# EAGLE design gerbang fix2 (EAGLE 6.6.0)
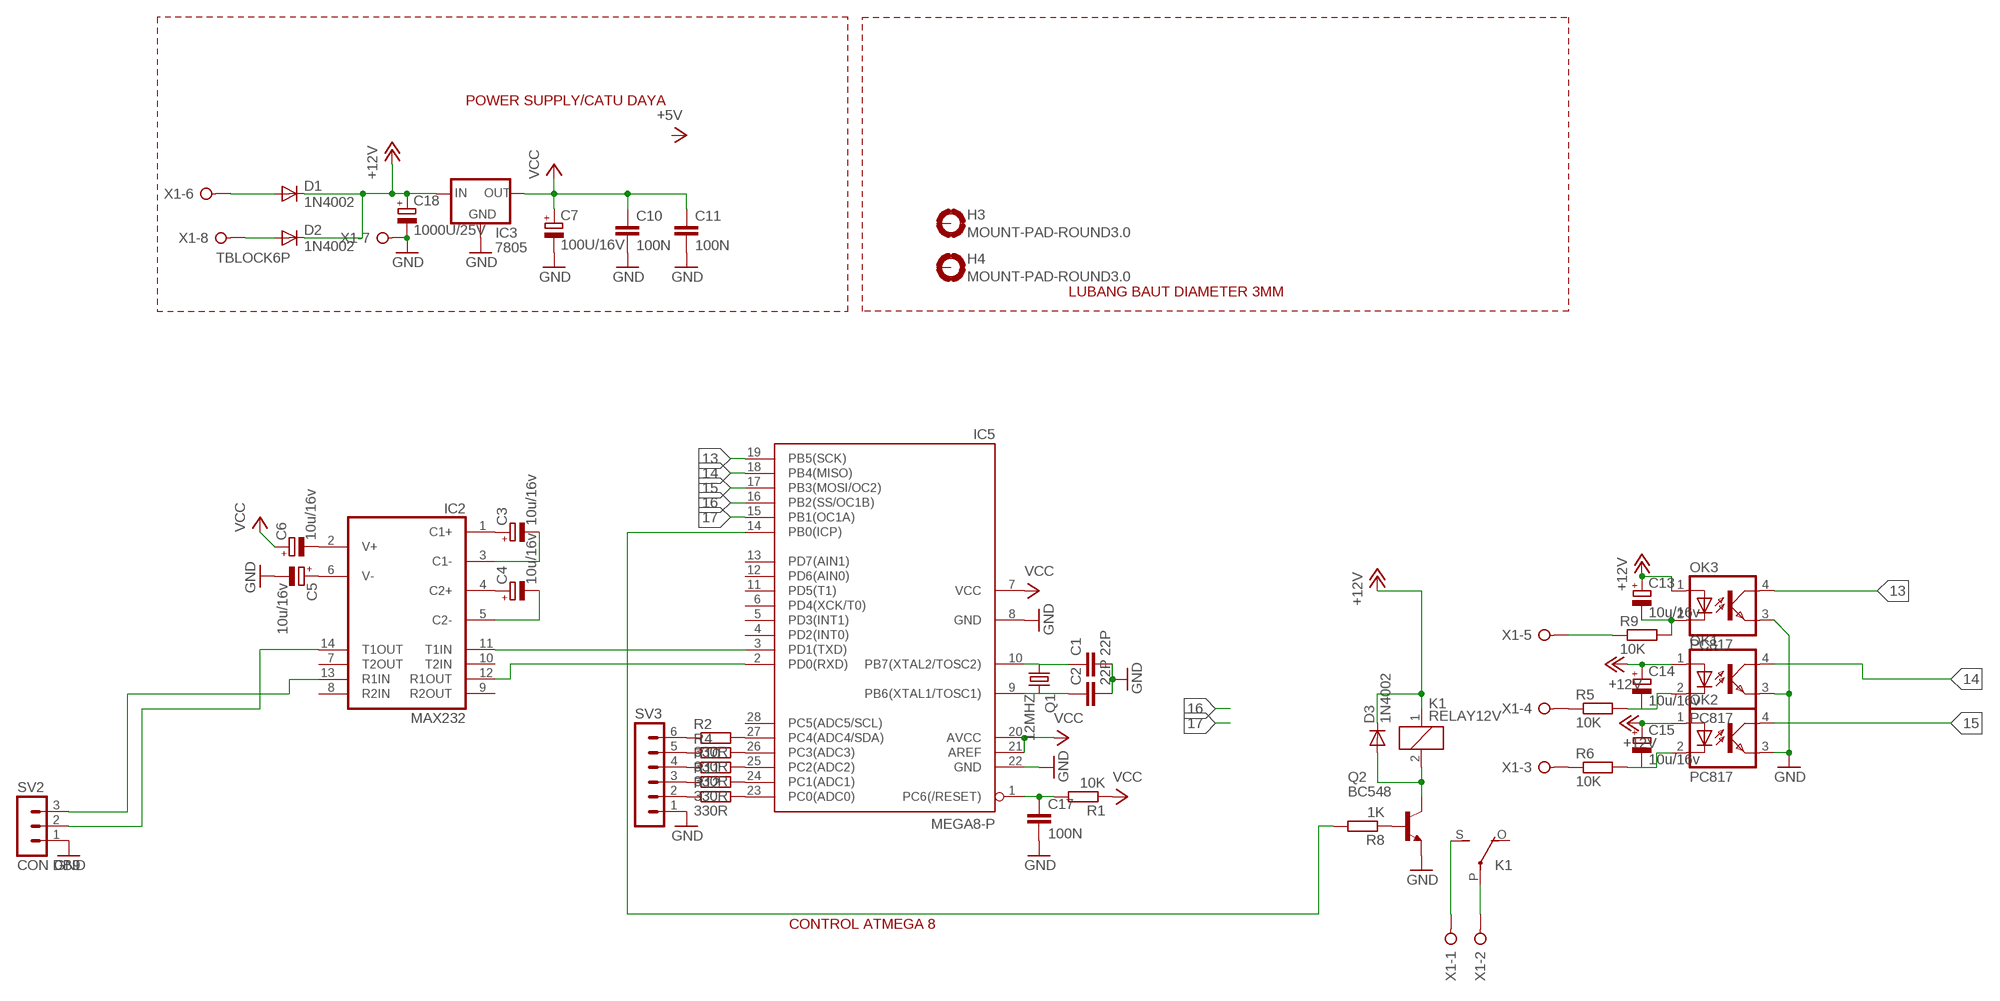
[diagram p0: schematic, sheet 1]

## Parts
C1  22P  C-EU025-025X050  [C025-025X050]
C2  22P  C-EU025-025X050  [C025-025X050]
C3  10u/16v  CPOL-EUE2.5-6  [E2,5-6]
C4  10u/16v  CPOL-EUE2.5-6  [E2,5-6]
C5  10u/16v  CPOL-EUE2.5-6  [E2,5-6]
C6  10u/16v  CPOL-EUE2.5-6  [E2,5-6]
C7  100U/16V  CPOL-EUE2.5-6  [E2,5-6]
C10  100N  C-EU025-025X050  [C025-025X050]
C11  100N  C-EU025-025X050  [C025-025X050]
C13  10u/16v  CPOL-EUE2.5-6  [E2,5-6]
C14  10u/16v  CPOL-EUE2.5-6  [E2,5-6]
C15  10u/16v  CPOL-EUE2.5-6  [E2,5-6]
C17  100N  C-EU025-025X050  [C025-025X050]
C18  1000U/25V  CPOL-EUE5-8.5  [E5-8,5]
D1  1N4002  1N4148DO35-10  [DO35-10]
D2  1N4002  1N4148DO35-10  [DO35-10]
D3  1N4002  1N4148DO35-10  [DO35-10]
H3  MOUNT-PAD-ROUND3.0  [3,0-PAD]
H4  MOUNT-PAD-ROUND3.0  [3,0-PAD]
IC2  MAX232  [DIL16]
IC3  7805  78XXS  [78XXS]
IC5  MEGA8-P  [DIL28-3]
K1  RELAY12V  ZF112  [ZF112]
OK1  PC817  [DIL04]
OK2  PC817  [DIL04]
OK3  PC817  [DIL04]
Q1  12MHZ  CRYSTALHC49U-V  [HC49U-V]
Q2  BC548  [TO92-EBC]
R1  10K  R-EU_0207/10  [0207/10]
R2  330R  R-EU_0204/2V  [0204V]
R4  330R  R-EU_0204/2V  [0204V]
R5  10K  R-EU_0204/2V  [0204V]
R6  10K  R-EU_0204/2V  [0204V]
R8  1K  R-EU_0207/10  [0207/10]
R9  10K  R-EU_0204/2V  [0204V]
R10  330R  R-EU_0204/2V  [0204V]
R11  330R  R-EU_0204/2V  [0204V]
R12  330R  R-EU_0204/2V  [0204V]
SV2  CON DB9  MA03-1  [MA03-1]
SV3  MA06-1  [MA06-1]
X1  TBLOCK6P  W237-08P  [W237-8P]

## Nets
13: IC5.19(PB5(SCK)) OK3.4(COL)
14: IC5.18(PB4(MISO)) OK1.4(COL)
15: IC5.17(PB3(MOSI/OC2)) OK2.4(COL)
16: IC5.16(PB2(SS/OC1B))
17: IC5.15(PB1(OC1A))
+12V: C13.+ C14.+ C15.+ C18.+ D1.C D2.C D3.C IC3.IN K1.1 OK1.1(A) OK2.1(A) OK3.1(A)
GND: C1.2 C2.2 C5.- C7.- C10.2 C11.2 C17.2 C18.- IC3.GND IC5.8(GND) IC5.22(GND) OK1.3(EMIT) OK2.3(EMIT) OK3.3(EMIT) Q2.E SV2.1 SV3.1 X1.7
N$1: C17.1 IC5.1(PC6(/RESET)) R1.2
N$4: IC5.14(PB0(ICP)) R8.2
N$8: R9.1 X1.5
N$9: D1.A X1.6
N$10: IC2.12(R1OUT) IC5.2(PD0(RXD))
N$11: IC2.11(T1IN) IC5.3(PD1(TXD))
N$12: C2.1 IC5.9(PB6(XTAL1/TOSC1)) Q1.2
N$13: C1.1 IC5.10(PB7(XTAL2/TOSC2)) Q1.1
N$15: R5.1 X1.4
N$16: C3.+ IC2.1(C1+)
N$17: C3.- IC2.3(C1-)
N$19: D2.A X1.8
N$20: IC5.27(PC4(ADC4/SDA)) R2.2
N$21: R6.1 X1.3
N$22: C4.+ IC2.4(C2+)
N$23: C4.- IC2.5(C2-)
N$24: C5.+ IC2.6(V-)
N$25: C6.- IC2.2(V+)
N$26: IC2.13(R1IN) SV2.3
N$27: IC2.14(T1OUT) SV2.2
N$29: K1.S(2:S) X1.1
N$30: K1.P(2:P) X1.2
N$31: C13.- OK3.2(C) R9.2
N$32: C14.- OK1.2(C) R5.2
N$33: C15.- OK2.2(C) R6.2
N$34: D3.A K1.2 Q2.C
N$35: IC5.26(PC3(ADC3)) R4.2
N$36: Q2.B R8.1
N$37: IC5.25(PC2(ADC2)) R10.2
N$38: IC5.24(PC1(ADC1)) R11.2
N$39: IC5.23(PC0(ADC0)) R12.2
N$40: R2.1 SV3.6
N$41: R4.1 SV3.5
N$42: R10.1 SV3.4
N$43: R11.1 SV3.3
N$44: R12.1 SV3.2
VCC: C6.+ C7.+ C10.1 C11.1 IC3.OUT IC5.7(VCC) IC5.20(AVCC) IC5.21(AREF) R1.1
Unconnected: H3.B3,0(MOUNT) H4.B3,0(MOUNT) IC2.7(T2OUT) IC2.8(R2IN) IC2.9(R2OUT) IC2.10(T2IN) IC5.4(PD2(INT0)) IC5.5(PD3(INT1)) IC5.6(PD4(XCK/T0)) IC5.11(PD5(T1)) IC5.12(PD6(AIN0)) IC5.13(PD7(AIN1)) IC5.28(PC5(ADC5/SCL)) K1.O(2:O)

## Notes on the sheet
- POWER SUPPLY/CATU DAYA
- LUBANG BAUT DIAMETER 3MM
- CONTROL ATMEGA 8

## Power pins joined to a net without a drawn wire
GND: IC2.15(GND)
VCC: IC2.16(VCC)

## Library data of the parts
C1 C2 C10 C11 C17 = resistor:C-EU: CAPACITOR, European symbol
C3-C7 C13-C15 = resistor:CPOL-EU: POLARIZED CAPACITOR, European symbol
C18 = rcl:CPOL-EU: POLARIZED CAPACITOR, European symbol
D1-D3 = diode:1N4148: DIODE high speed (Philips)
H3 H4 = holes:MOUNT-PAD-ROUND: MOUNTING PAD, round
IC2 = maxim:MAX232: RS232 TRANSEIVER; MF: MAXIM; MPN: MAX232ACPE+; OC_FARNELL: 9723773; OC_NEWARK: 68K4544
IC3 = v-reg:78XXS: VOLTAGE REGULATOR
IC5 = atmel:MEGA8-P: MICROCONTROLLER 8 Kbytes FLASH, 1 kbytes SRAM, 512 bytes EEPROM, USART, 4-channel 10 bit ADC, 2-channel 8 bit ADC Pin compatible with Atmega48, ATMega88, ATMega168 Source: avr.lbr; OC_FARNELL: unknown; OC_NEWARK: unknown
K1 = relay:ZF112: RELAY 1 x switch; OC_FARNELL: unknown; OC_NEWARK: unknown
OK1-OK3 = optocoupler:PC817: SHARP OPTO COUPLER; MPN: PC817X4J000F; OC_FARNELL: 9707727; OC_NEWARK: 97K7059
Q1 = crystal:CRYSTAL: CRYSTAL; OC_FARNELL: 1666969; OC_NEWARK: unknown
Q2 = transistor-npn:BC548*: NPN Transistor
R1 R8 = resistor:R-EU_: RESISTOR, European symbol
R2 R4-R6 R9-R12 = rcl:R-EU_: RESISTOR, European symbol
SV2 = con-lstb:MA03-1: PIN HEADER; OC_FARNELL: unknown; OC_NEWARK: unknown
SV3 = con-lstb:MA06-1: PIN HEADER; OC_FARNELL: unknown; OC_NEWARK: unknown
X1 = con-wago-508:W237-08P: WAGO SREW CLAMP; OC_FARNELL: unknown; OC_NEWARK: unknown

## Board
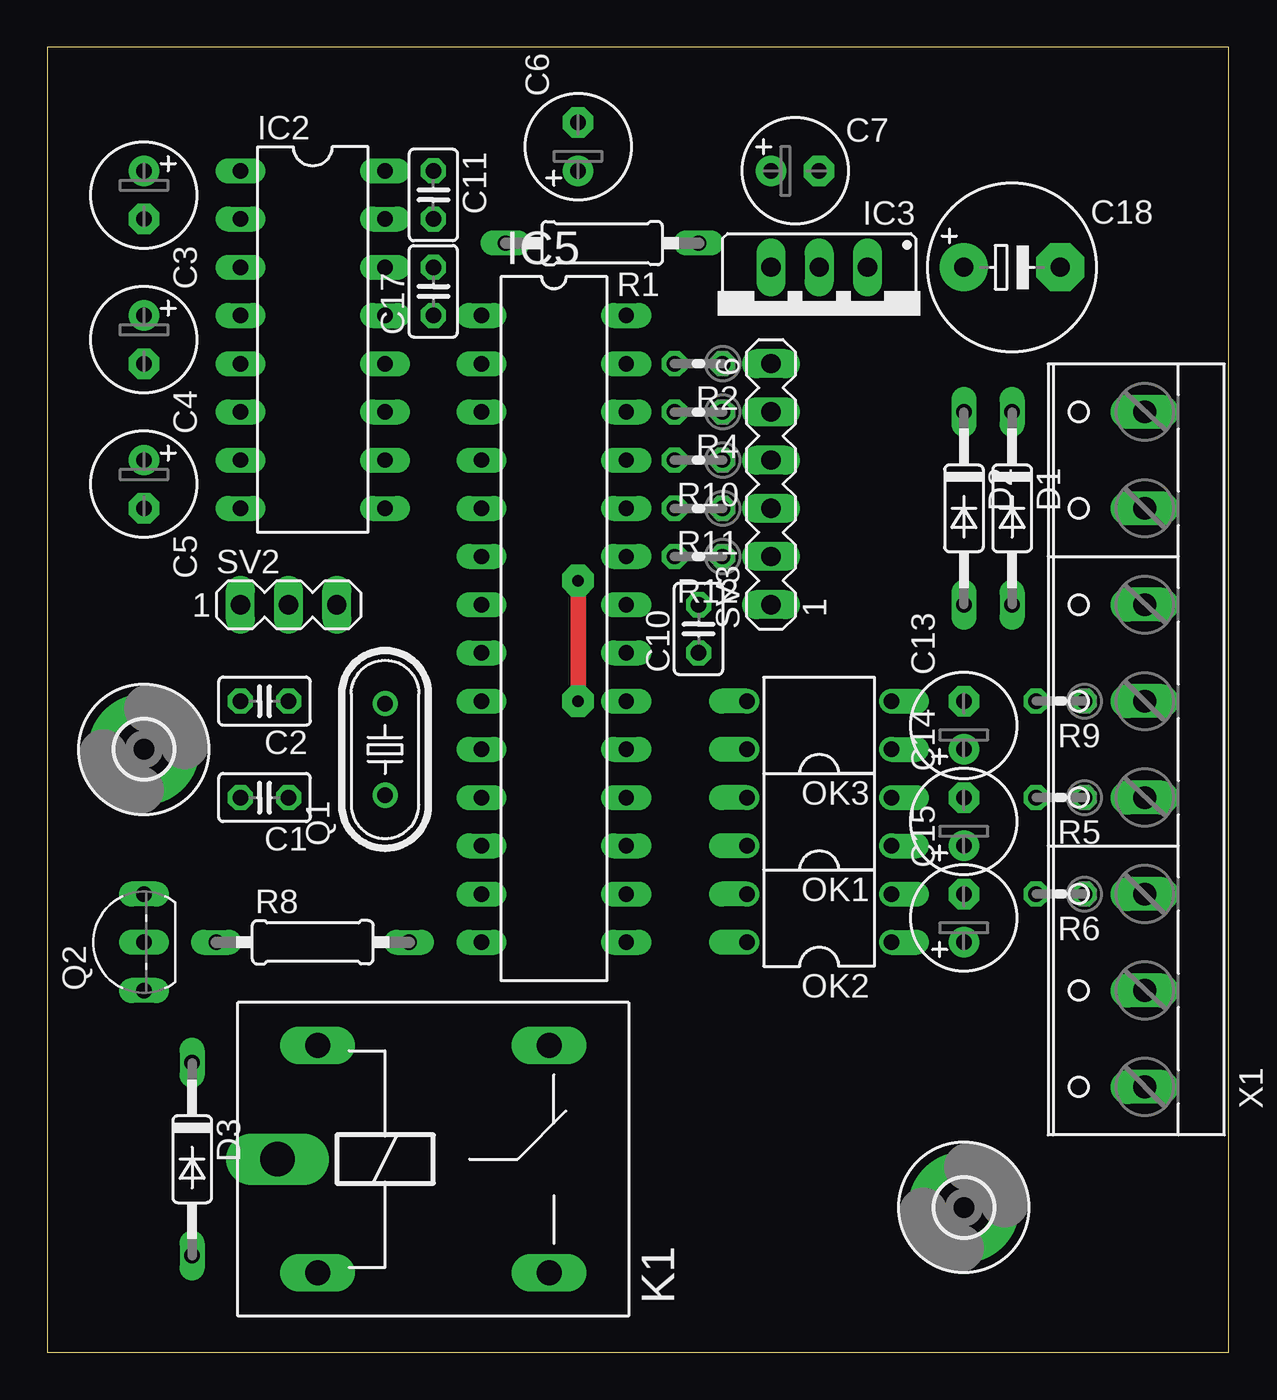
[diagram p1: board, top side]
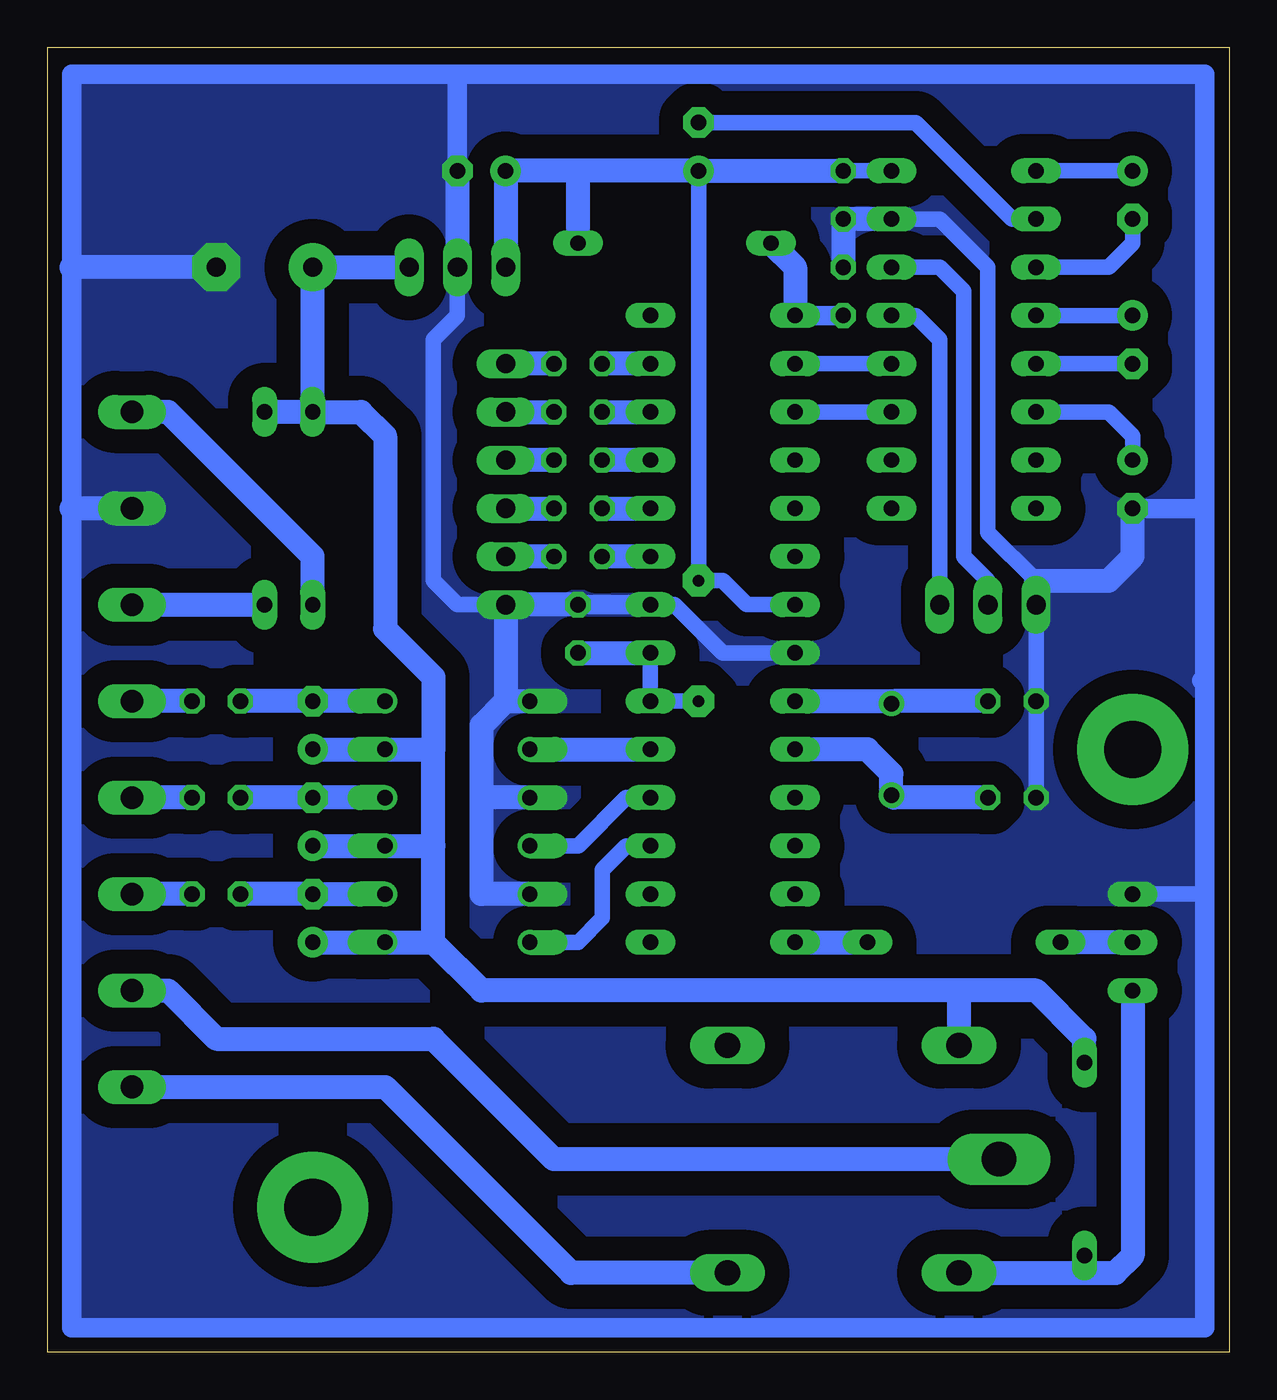
[diagram p2: board, bottom side, seen from below]

Size 62.22 x 68.73 mm. Coordinates in mm from the lower left corner, seen from the top.
Outline: 0,0 62.22,0 62.22,68.73 0,68.73 0,0
Copper layers (1*16): Top 0.035mm / dielectric 1.5mm / Bottom 0.035mm
Design rules "default": minimum track width 10mil, minimum drill 24mil, track to track 8mil, track to pad 8mil, pad to pad 8mil, via to via 8mil, smd to smd 8mil, copper to edge 40mil, drill to drill 8mil, minimum pad ring 10mil, minimum via ring 8mil, stop-mask expansion 4mil, vias tented up to drill 0mil, thermal gap 10mil

### Footprints (pad centres in the part's own frame; a part is rotated, then mirrored left to right if it is on the bottom)
C025-025X050 = drill 0.813 octagon: 1 -1.27,0; 2 1.27,0
E2,5-6 = drill 0.813 pad 1.6: + -1.27,0 | drill 0.813 pad 1.6 octagon: - 1.27,0
E5-8,5 = drill 1.016 pad 2.54: + -2.54,0 | drill 1.016 pad 2.54 octagon: - 2.54,0
DO35-10 = drill 0.813 long: A 5.08,0; C -5.08,0
3,0-PAD = drill 3 pad 5.842: B3,0 0,0
DIL16 = drill 0.813 long: 1 -8.89,-3.81; 2 -6.35,-3.81; 3 -3.81,-3.81; 4 -1.27,-3.81; 5 1.27,-3.81; 6 3.81,-3.81; 7 6.35,-3.81; 8 8.89,-3.81; 9 8.89,3.81; 10 6.35,3.81; 11 3.81,3.81; 12 1.27,3.81; 13 -1.27,3.81; 14 -3.81,3.81; 15 -6.35,3.81; 16 -8.89,3.81
78XXS = drill 1.016 long: GND 0,-2.54; IN -2.54,-2.54; OUT 2.54,-2.54
DIL28-3 = drill 0.813 long: 1 -16.51,-3.81; 2 -13.97,-3.81; 3 -11.43,-3.81; 4 -8.89,-3.81; 5 -6.35,-3.81; 6 -3.81,-3.81; 7 -1.27,-3.81; 8 1.27,-3.81; 9 3.81,-3.81; 10 6.35,-3.81; 11 8.89,-3.81; 12 11.43,-3.81; 13 13.97,-3.81; 14 16.51,-3.81; 15 16.51,3.81; 16 13.97,3.81; 17 11.43,3.81; 18 8.89,3.81; 19 6.35,3.81; 20 3.81,3.81; 21 1.27,3.81; 22 -1.27,3.81; 23 -3.81,3.81; 24 -6.35,3.81; 25 -8.89,3.81; 26 -11.43,3.81; 27 -13.97,3.81; 28 -16.51,3.81
ZF112 = drill 1.321 long: 1 -6.096,5.994; 2 -6.096,-5.994; O 6.096,5.994; S 6.096,-5.994 | drill 1.803 long: P -8.204,0
DIL04 = drill 0.813 offset: 1 -1.27,-3.81; 2 1.27,-3.81; 3 1.27,3.81; 4 -1.27,3.81
HC49U-V = drill 0.813: 1 -2.413,0; 2 2.413,0
TO92-EBC = drill 0.813 long: B 0,-1.27; C -2.54,-1.27; E 2.54,-1.27
0207/10 = drill 0.813 long: 1 -5.08,0; 2 5.08,0
0204V = drill 0.813 octagon: 1 -1.27,0; 2 1.27,0
MA03-1 = drill 1.016 long: 1 -2.54,0; 2 0,0; 3 2.54,0
MA06-1 = drill 1.016 long: 1 -6.35,0; 2 -3.81,0; 3 -1.27,0; 4 1.27,0; 5 3.81,0; 6 6.35,0
W237-8P = drill 1.194 long: 1 -17.78,-0.635; 2 -12.7,-0.635; 3 -7.62,-0.635; 4 -2.54,-0.635; 5 2.54,-0.635; 6 7.62,-0.635; 7 12.7,-0.635; 8 17.78,-0.635

### Placement (x,y rotation side)
C1  11.43,29.21 180 top
C2  11.43,34.29 180 top
C3  5.08,60.96 270 top
C4  5.08,53.34 270 top
C5  5.08,45.72 270 top
C6  27.94,63.5 90 top
C7  39.37,62.23 0 top
C10  34.29,38.1 90 top
C11  20.32,60.96 270 top
C13  48.26,33.02 90 top
C14  48.26,27.94 90 top
C15  48.26,22.86 90 top
C17  20.32,55.88 90 top
C18  50.8,57.15 0 top
D1  50.8,44.45 270 top
D2  48.26,44.45 270 top
D3  7.62,10.16 270 top
H3  5.08,31.75 0 top
H4  48.26,7.62 0 top
IC2  13.97,53.34 270 top
IC3  40.64,54.61 180 top
IC5  26.67,38.1 270 top
K1  20.32,10.16 0 top
OK1  40.64,27.94 90 top
OK2  40.64,22.86 90 top
OK3  40.64,33.02 90 top
Q1  17.78,31.75 90 top
Q2  3.81,21.59 90 top
R1  29.21,58.42 180 top
R2  34.29,52.07 180 top
R4  34.29,49.53 180 top
R5  53.34,29.21 180 top
R6  53.34,24.13 180 top
R8  13.97,21.59 0 top
R9  53.34,34.29 180 top
R10  34.29,46.99 180 top
R11  34.29,44.45 180 top
R12  34.29,41.91 180 top
SV2  12.7,39.37 0 top
SV3  38.1,45.72 90 top
X1  57.15,31.75 90 top

### Tracks (layer width: path | path; a pad name or v marks a point on that pad's centre or on a via)
13
  Bottom 1.27: OK3.4 IC5.19
14
  Bottom 0.813: IC5.18 31.75,29.21 34.29,26.67 OK1.4
15
  Bottom 0.813: IC5.17 31.75,26.67 33.02,25.4 33.02,22.86 34.29,21.59 OK2.4
+12V
  Bottom 1.27: 41.91,21.59 41.91,26.67 | 41.91,26.67 41.91,31.75 | C13.+ OK3.1 41.91,31.75 | OK1.1 C14.+ 41.91,26.67 | C15.+ OK2.1 41.91,21.59 | D2.C D1.C | 41.91,31.75 41.91,35.56 44.45,38.1 44.45,48.26 45.72,49.53 D2.C | 13.97,19.05 10.16,19.05 7.62,16.51 D3.C | 13.97,19.05 39.37,19.05 41.91,21.59 | K1.1 14.22,18.8 13.97,19.05 | D2.C C18.+ IC3.IN
GND
  Bottom 0.813: IC5.8 26.67,36.83 29.21,39.37 IC5.22 | IC2.15 15.24,59.69 12.7,57.15 12.7,43.18 10.16,40.64 SV2.1 C2.2 C1.2 | Q2.E 1.27,24.13 | SV3.1 40.64,39.37 41.91,40.64 41.91,53.34 40.64,54.61 IC3.GND
  Bottom 1.016: 40.64,67.31 1.27,67.31 1.27,44.45 | 40.64,67.31 60.96,67.31 60.96,57.15 60.96,44.45 60.96,1.27 1.27,1.27 1.27,24.13 1.27,35.56 | 1.27,35.56 1.27,44.45 | 1.27,44.45 C5.- | 1.45,35.38 1.27,35.56 | C10.2 IC5.22 | C7.- 40.64,67.31
  Bottom 1.27: C7.- IC3.GND | C10.2 SV3.1 38.1,34.29 | OK2.3 39.37,24.13 39.37,29.21 | 39.37,29.21 39.37,33.02 38.1,34.29 | 38.1,34.29 OK3.3 | OK1.3 39.37,29.21 | X1.7 60.96,44.45 | 10.16,40.64 6.35,40.64 5.08,41.91 C5.- | IC2.15 C11.2 C17.2 | C18.- 60.96,57.15
  pour Bottom (isolate 1.27, no thermals): 0,68.73 62.38,68.73 62.23,0 0,0
N$1
  Bottom 1.016: C17.1 IC5.1
  Bottom 1.27: R1.2 22.86,57.15 IC5.1
N$4
  Bottom 1.27: IC5.14 R8.2
N$8
  Bottom 1.27: R9.1 X1.5
N$9
  Bottom 1.27: X1.6 D1.A
N$10
  Bottom 0.813: IC2.12 IC5.2
N$11
  Bottom 0.813: IC5.3 IC2.11
N$12
  Bottom 1.27: IC5.9 17.91,34.29 Q1.2 17.65,34.29 C2.1
N$13
  Bottom 1.27: IC5.10 19.05,31.75 17.78,30.48 Q1.1 17.65,29.21 C1.1
N$15
  Bottom 1.27: R5.1 X1.4
N$16
  Bottom 0.813: C3.+ IC2.1
N$17
  Bottom 0.813: C3.- 5.08,58.42 6.35,57.15 IC2.3
N$19
  Bottom 1.27: D2.A 48.26,41.91 55.88,49.53 X1.8
N$20
  Bottom 1.27: IC5.27 R2.2
N$21
  Bottom 1.27: R6.1 X1.3
N$22
  Bottom 0.813: C4.+ IC2.4
N$23
  Bottom 0.813: C4.- IC2.5
N$24
  Bottom 0.813: C5.+ 5.08,48.26 6.35,49.53 IC2.6
N$25
  Bottom 0.813: IC2.2 11.43,59.69 16.51,64.77 C6.-
N$26
  Bottom 0.813: IC2.13 16.51,54.61 15.24,53.34 SV2.3
N$27
  Bottom 0.813: IC2.14 15.24,57.15 13.97,55.88 13.97,41.91 12.7,40.64 SV2.2
N$29
  Bottom 1.27: X1.1 44.45,13.97 34.65,4.17 K1.S
N$30
  Bottom 1.27: K1.P 35.56,10.16 41.91,16.51 53.34,16.51 55.88,19.05 X1.2
N$31
  Bottom 1.27: OK3.2 C13.- R9.2
N$32
  Bottom 1.27: OK1.2 C14.- R5.2
N$33
  Bottom 1.27: OK2.2 C15.- R6.2
N$34
  Bottom 1.27: Q2.C 5.08,5.08 5.99,4.17 7.62,4.17 | K1.2 7.62,4.17 | D3.A 7.62,4.17
N$35
  Bottom 1.27: R4.2 IC5.26
N$36
  Bottom 1.27: Q2.B R8.1
N$37
  Bottom 1.27: IC5.25 R10.2
N$38
  Bottom 1.27: R11.2 IC5.24
N$39
  Bottom 1.27: IC5.23 R12.2
N$40
  Bottom 1.27: R2.1 SV3.6
N$41
  Bottom 1.27: SV3.5 R4.1
N$42
  Bottom 1.27: R10.1 SV3.4
N$43
  Bottom 1.27: SV3.3 R11.1
N$44
  Bottom 1.27: R12.1 SV3.2
VCC  (via drill 0.6 pad 1.68)
  Top 0.813: v27.94,40.64 v27.94,34.29
  Bottom 0.813: IC2.16 C11.1 | IC5.7 25.4,39.37 26.67,40.64 v27.94,40.64 C6.+ | IC5.21 IC5.20 v27.94,34.29
  Bottom 1.27: IC3.OUT C7.+ 34.29,62.23 | C10.1 IC5.21 | 34.29,62.23 C6.+ C11.1 | R1.1 34.29,62.23